# EAGLE schematic Gorden_ (EAGLE 7.6.0)
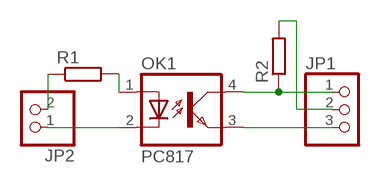
[diagram p0: schematic, sheet 1]

## Parts
JP1  PINHD-1X3  [1X03]
JP2  PINHD-1X2  [1X02]
OK1  PC817  [DIL04]
R1  R-EU_0204/7  [0204/7]
R2  R-EU_0204/7  [0204/7]

## Nets
N$1: JP1.3 OK1.3(EMIT)
N$2: OK1.1(A) R1.2
N$3: JP1.1 OK1.4(COL) R2.1
N$4: JP1.2 R2.2
N$5: JP2.2 R1.1
N$6: JP2.1 OK1.2(C)

## Library data of the parts
JP1 = pinhead:PINHD-1X3: PIN HEADER
JP2 = pinhead:PINHD-1X2: PIN HEADER
OK1 = optocoupler:PC817: SHARP OPTO COUPLER; MPN: PC817X4J000F; OC_FARNELL: 9707727; OC_NEWARK: 97K7059
R1 R2 = rcl:R-EU_: RESISTOR, European symbol